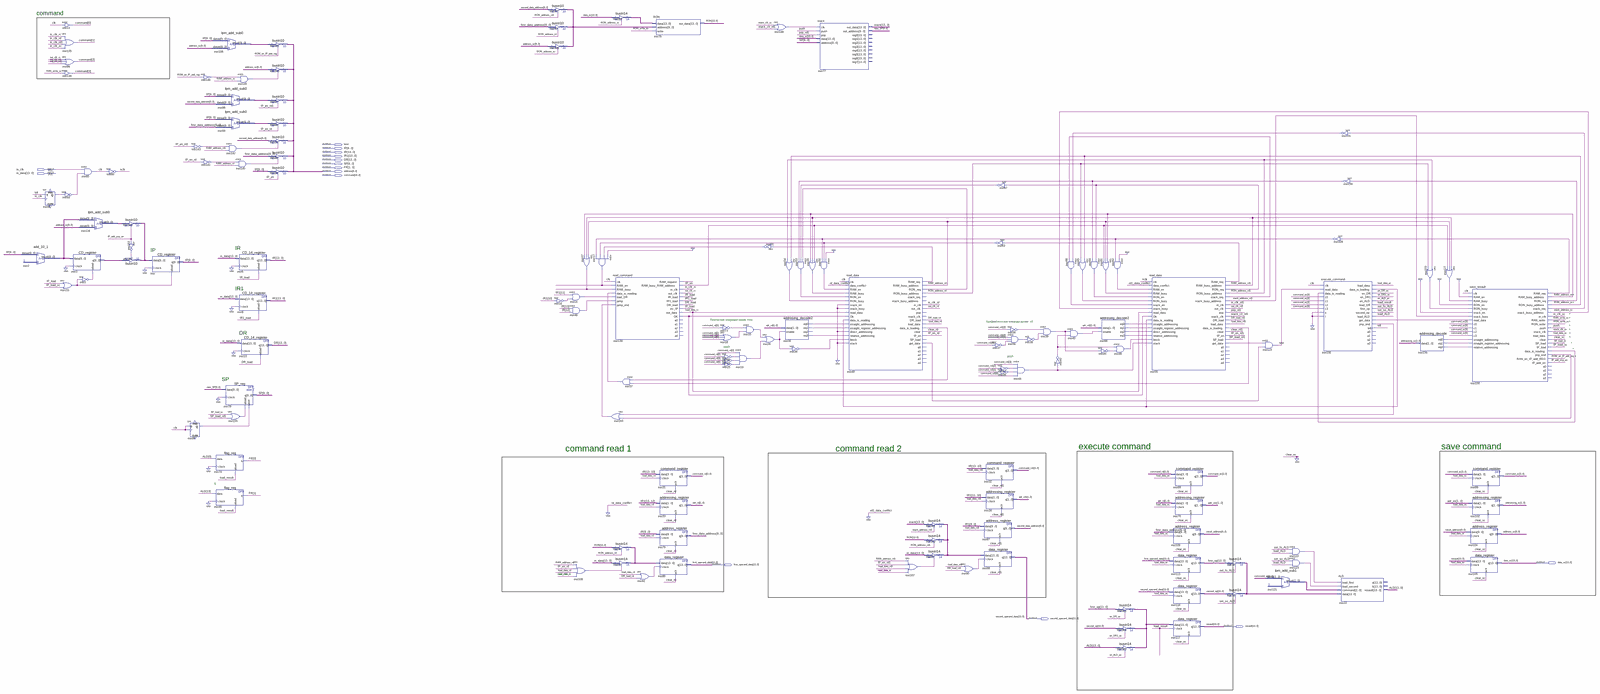
[diagram p0: schematic sheet, whole]
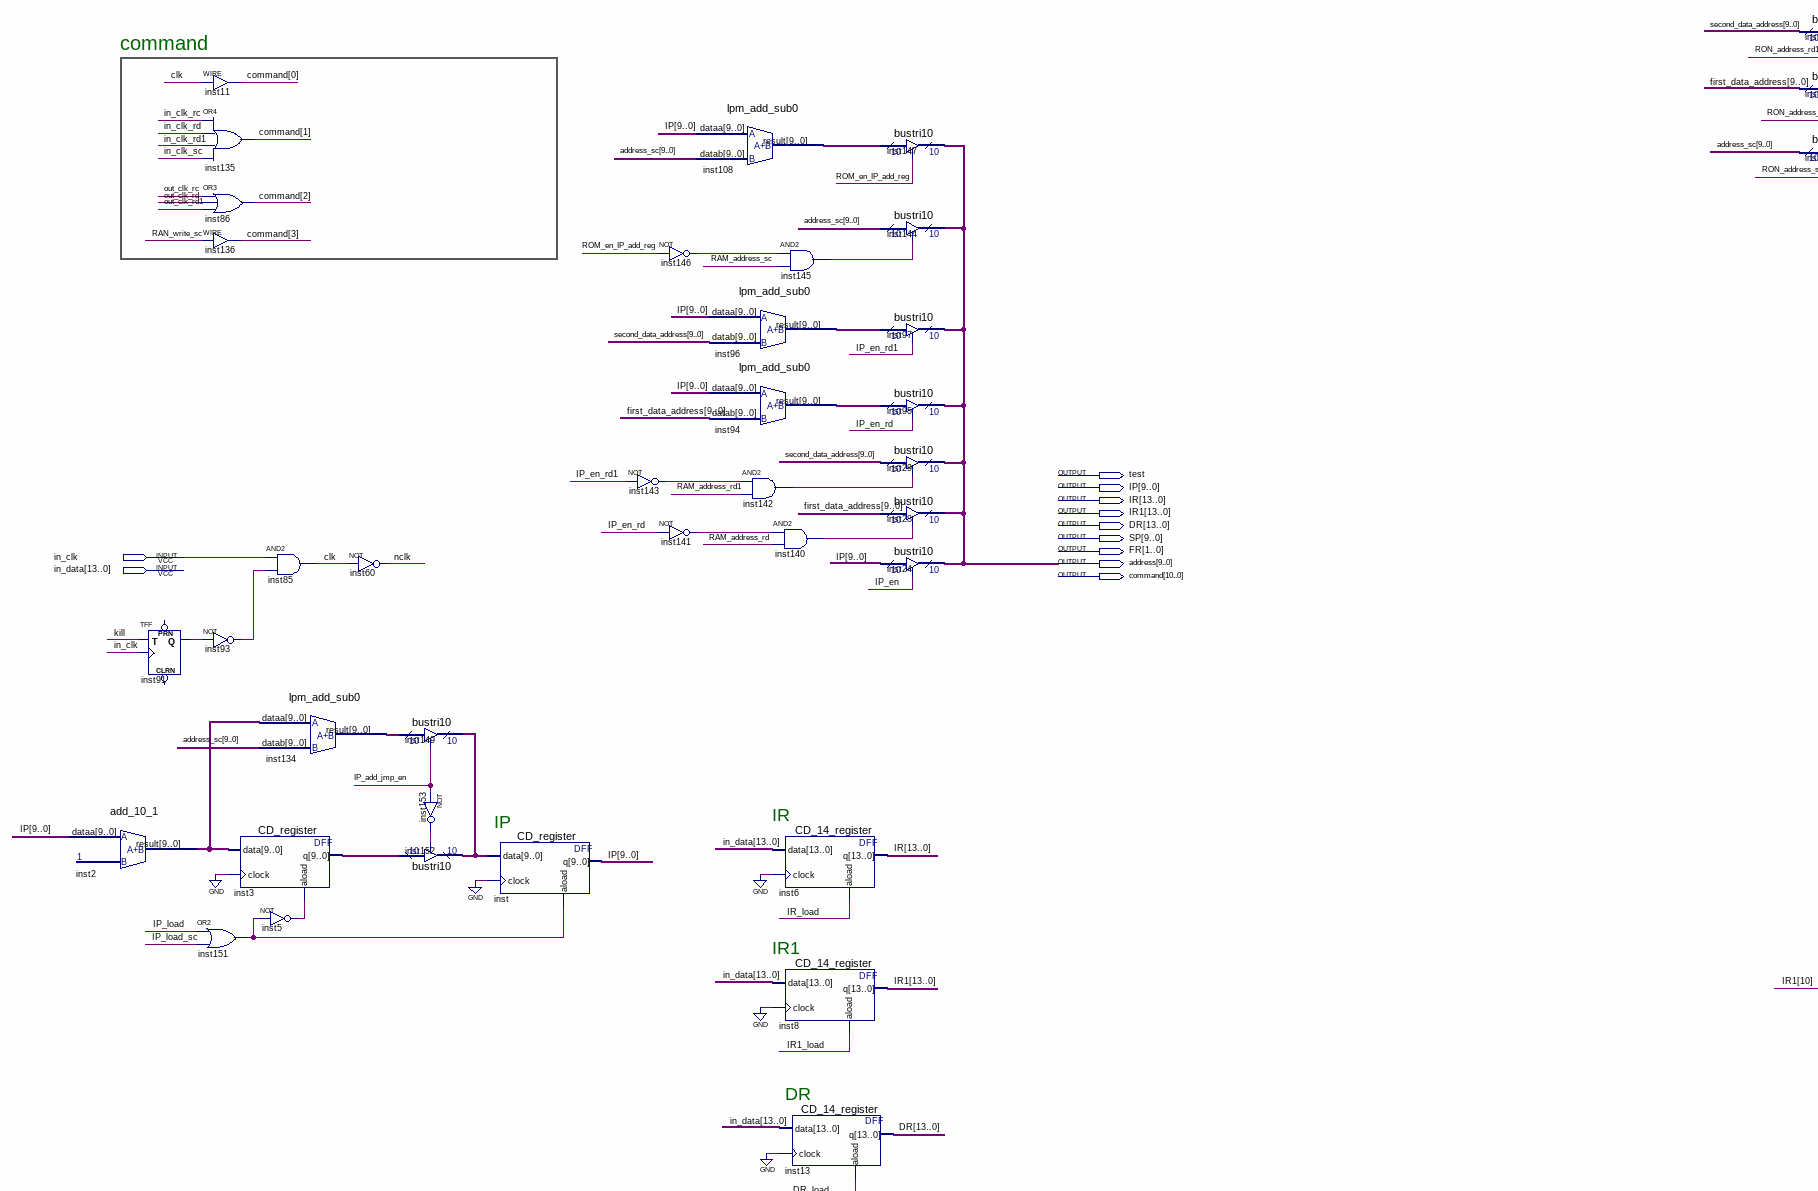
[diagram p1: schematic sheet, upper left part]
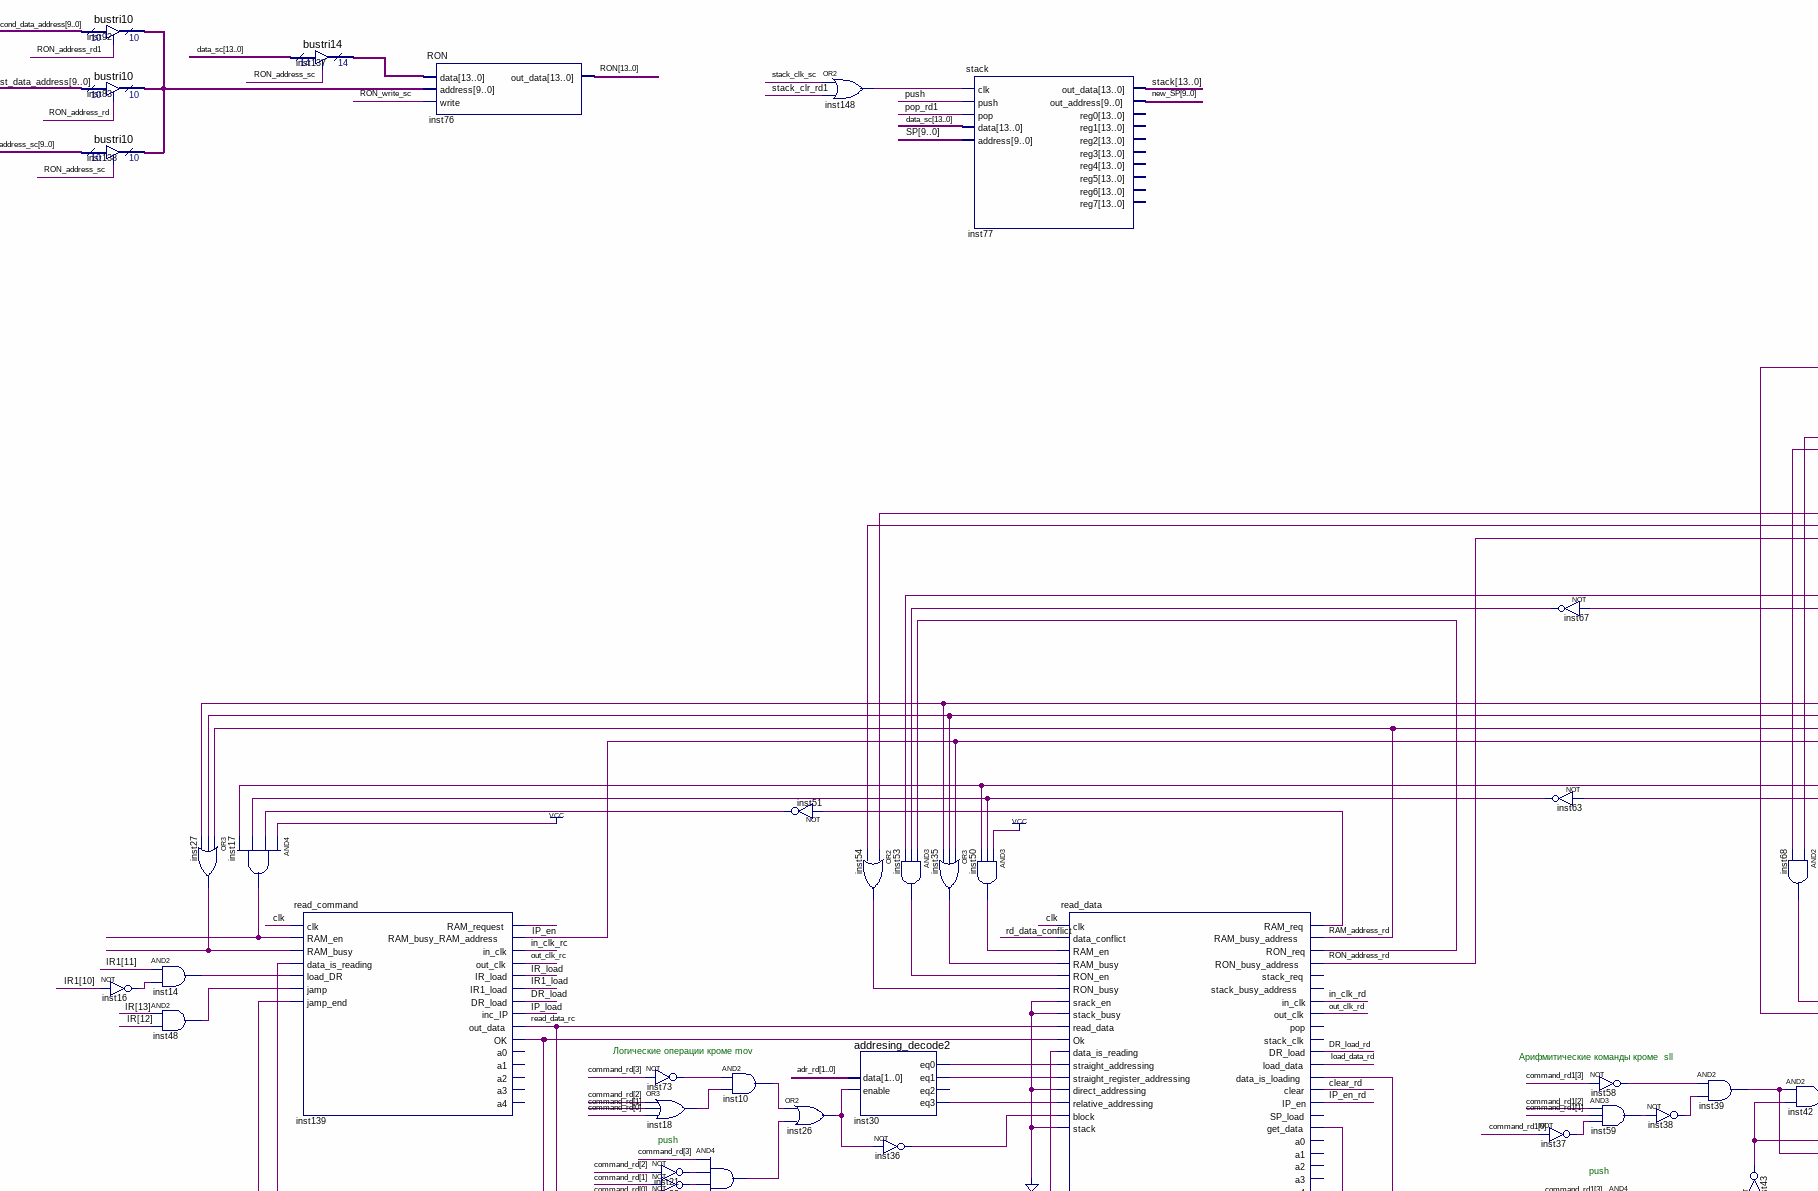
[diagram p2: schematic sheet, upper centre part]
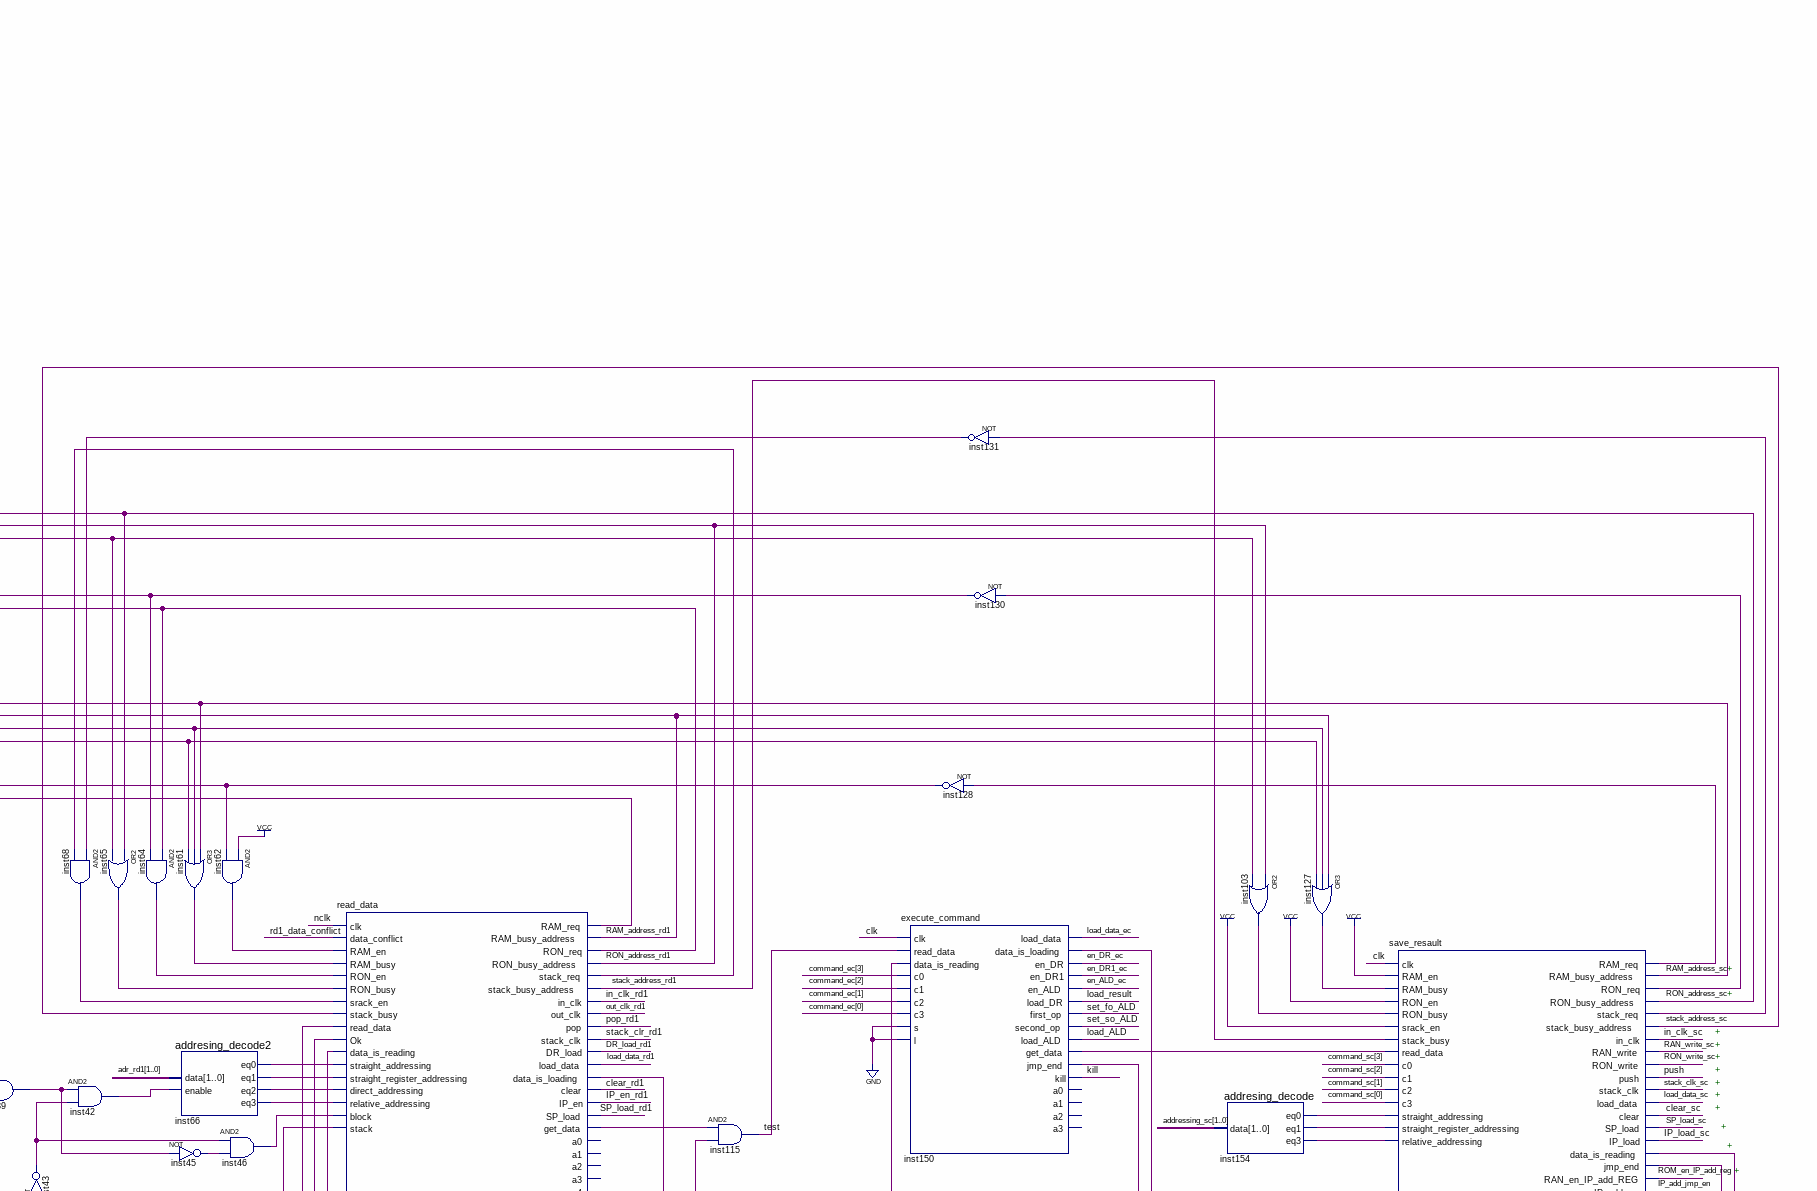
[diagram p3: schematic sheet, upper right part]
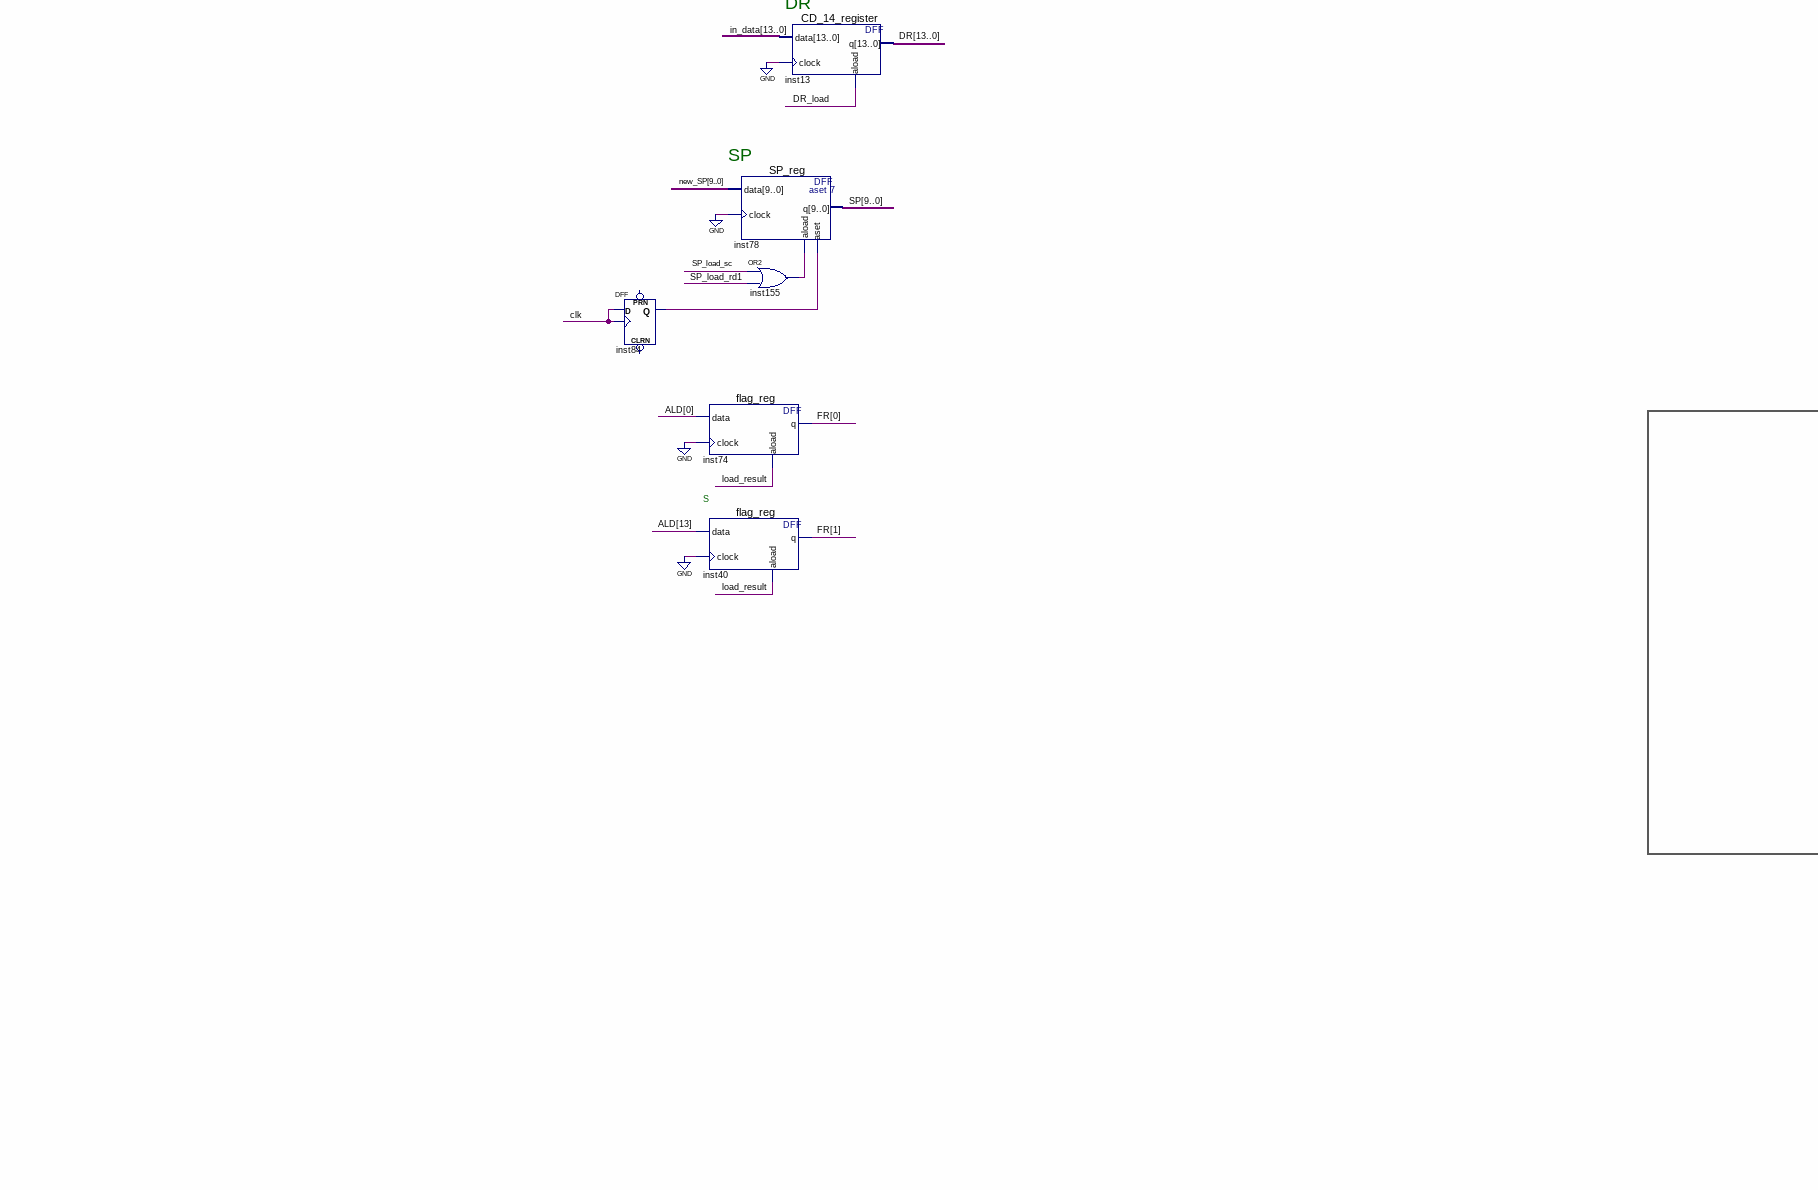
[diagram p4: schematic sheet, lower left part]
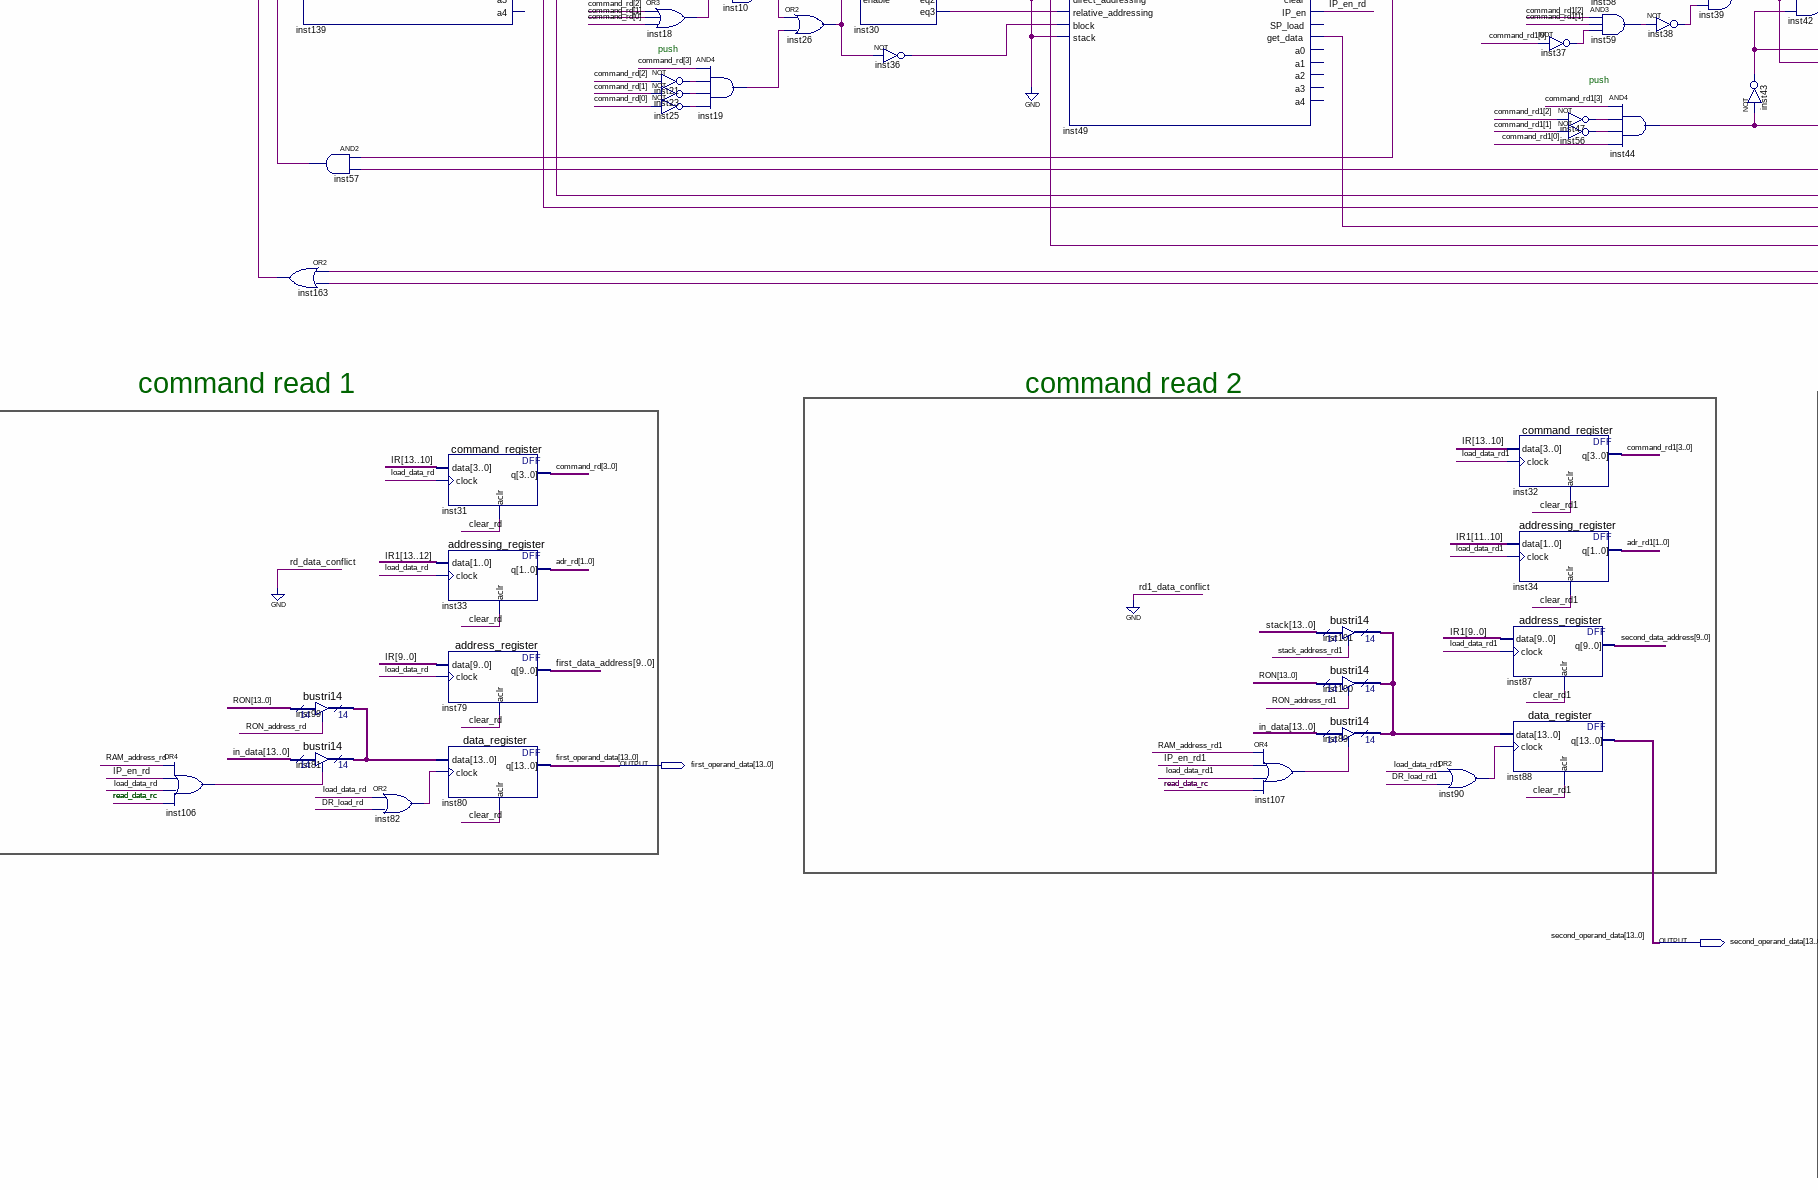
[diagram p5: schematic sheet, lower centre part]
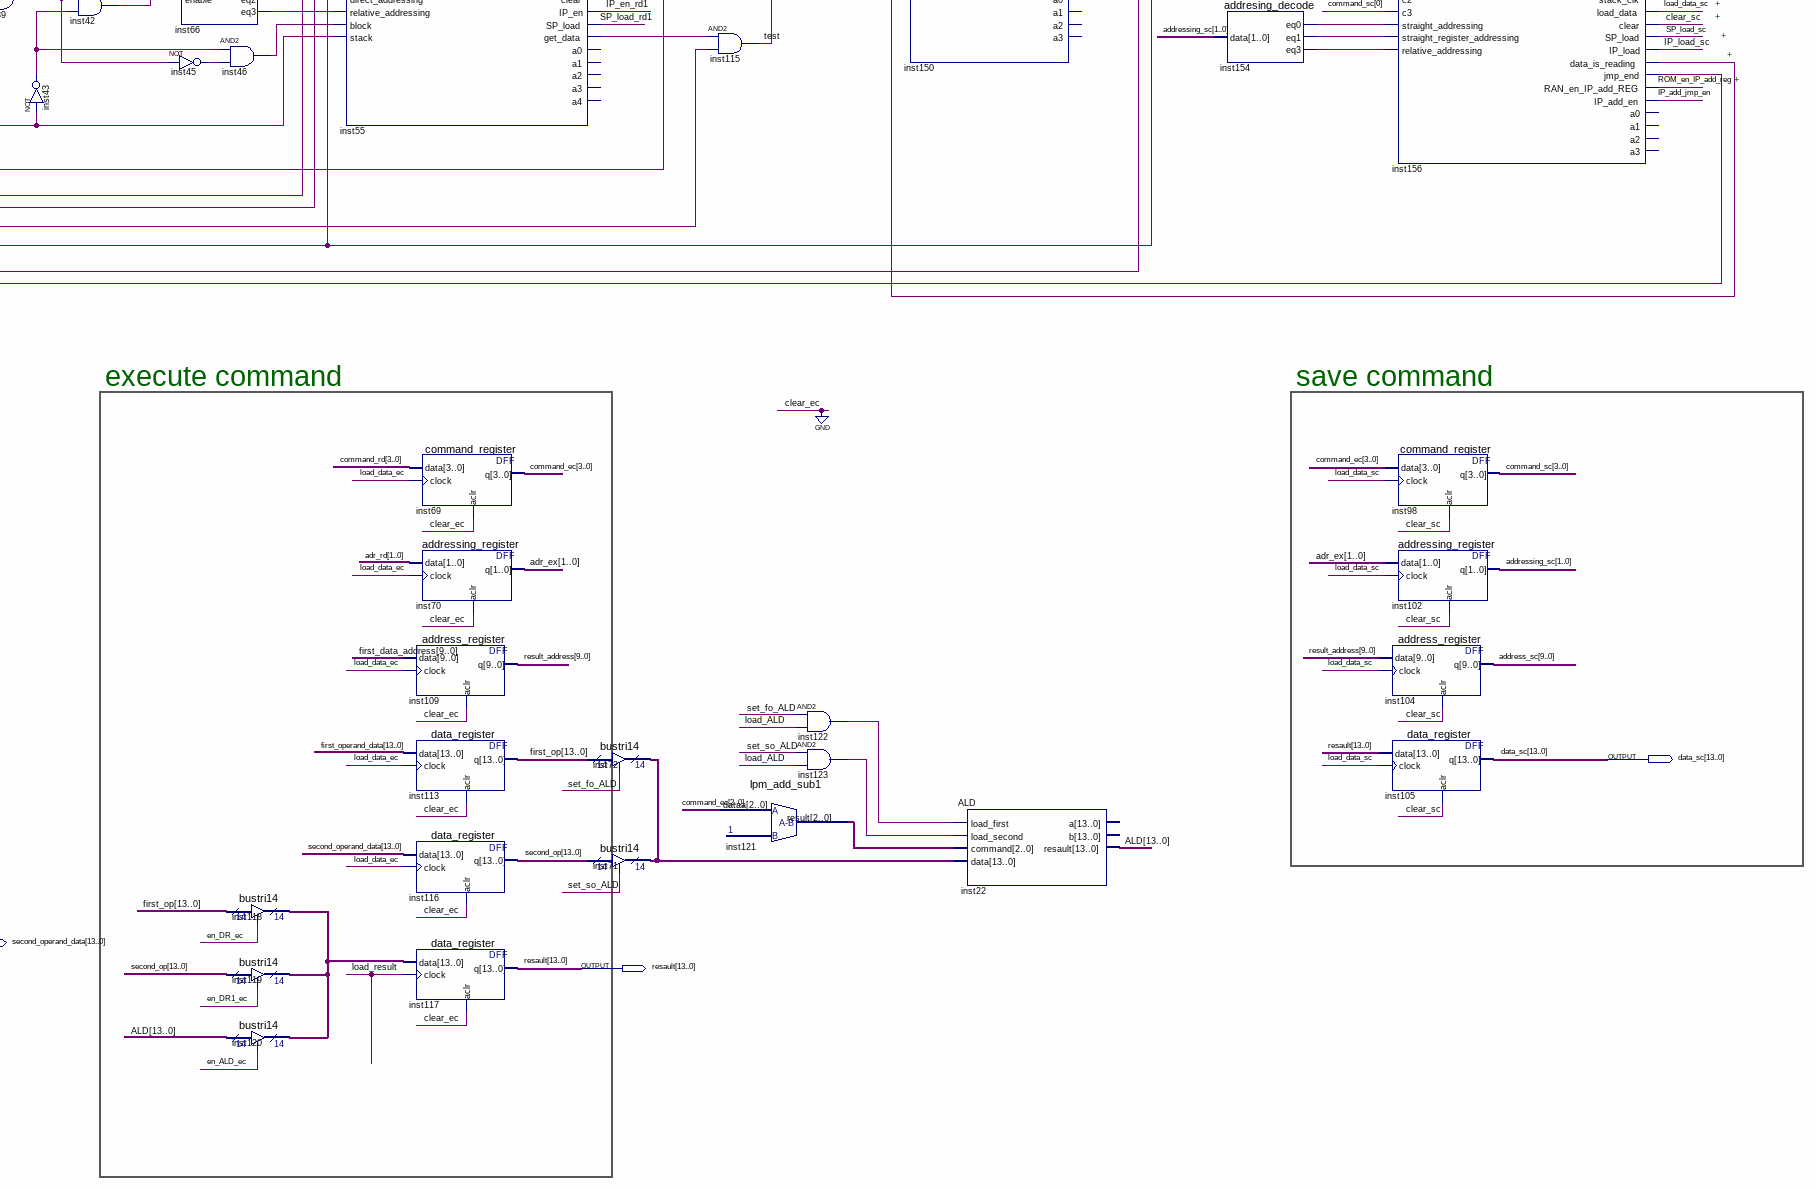
[diagram p6: schematic sheet, lower right part]
// Quartus schematic CD.bdf as structural Verilog: 138 symbols, 15 pins
module CD (
  input  in_clk,
  input  [13:0] in_data,
  output test,
  output [9:0] IP,
  output [13:0] IR,
  output [13:0] IR1,
  output [13:0] DR,
  output [9:0] SP,
  output [1:0] FR,
  output [9:0] address,
  output [10:0] command,
  output [13:0] data_sc,
  output [13:0] first_operand_data,
  output [13:0] second_operand_data,
  output [13:0] resault
);

  wire clear_rd, clear_rd1, clear_sc, clk, DR_load, DR_load_rd, DR_load_rd1, en_ALD_ec, en_DR1_ec, en_DR_ec,
       in_clk_rc, in_clk_rd, in_clk_rd1, in_clk_sc, inst5_out, inst10_out, inst14_out, inst16_out,
       inst17_out, inst18_out, inst19_out, inst21_out, inst23_out, inst25_out, inst26_out, inst27_out,
       inst30_eq0, inst30_eq1, inst30_eq3, inst35_out, inst36_out, inst37_out, inst38_out, inst39_out,
       inst42_out, inst43_out, inst44_out, inst45_out, inst46_out, inst47_out, inst48_out,
       inst49_data_is_loading, inst49_get_data, inst49_ram_req, inst49_ron_req, inst50_out, inst51_out,
       inst53_out, inst54_out, inst55_data_is_loading, inst55_get_data, inst55_ram_req, inst55_ron_req,
       inst55_stack_req, inst56_out, inst57_out, inst58_out, inst59_out, inst61_out, inst62_out, inst63_out,
       inst64_out, inst65_out, inst66_eq0, inst66_eq1, inst66_eq2, inst66_eq3, inst67_out, inst68_out,
       inst73_out, inst82_out, inst84_q, inst90_out, inst91_q, inst93_out, inst103_out, inst106_out,
       inst107_out, inst122_out, inst123_out, inst127_out, inst128_out, inst130_out, inst131_out, inst139_ok,
       inst139_ram_request, inst140_out, inst141_out, inst142_out, inst143_out, inst145_out, inst146_out,
       inst148_out, inst150_data_is_loading, inst150_get_data, inst150_jmp_end, inst151_out, inst153_out,
       inst154_eq0, inst154_eq1, inst154_eq3, inst155_out, inst156_data_is_reading, inst156_jmp_end,
       inst156_ram_req, inst156_ron_req, inst156_stack_req, inst163_out, IP_add_jmp_en, IP_en, IP_en_rd,
       IP_en_rd1, IP_load, IP_load_sc, IR1_load, IR_load, kill, load_ALD, load_data_ec, load_data_rd,
       load_data_rd1, load_data_sc, load_result, nclk, out_clk_rc, out_clk_rd, out_clk_rd1, pop_rd1, push,
       RAM_address_rd, RAM_address_rd1, RAM_address_sc, RAN_write_sc, read_data_rc, ROM_en_IP_add_reg,
       RON_address_rd, RON_address_rd1, RON_address_sc, RON_write_sc, set_fo_ALD, set_so_ALD, SP_load_rd1,
       SP_load_sc, stack_address_rd1, stack_address_sc, stack_clk_sc, stack_clr_rd1;
  wire [1:0] addressing_sc, adr_ex, adr_rd, adr_rd1;
  wire [2:0] inst121_result;
  wire [3:0] command_ec, command_rd, command_rd1, command_sc;
  wire [9:0] address_sc, first_data_address, inst2_result, inst3_q, inst92_tridata, inst94_result,
       inst96_result, inst108_result, inst134_result, inst149_tridata, new_SP, result_address,
       second_data_address;
  wire [13:0] ALD, first_op, inst72_tridata, inst99_tridata, inst101_tridata, inst118_tridata,
       inst137_tridata, RON, second_op, stack;

  add_10_1 inst2 (.dataa(IP), .result(inst2_result));
  TFF inst91 (.T(kill), .CLK(in_clk), .Q(inst91_q));  // open: PRN, CLRN
  assign command[0] = clk;  // WIRE inst11
  or inst135 (command[1], in_clk_rc, in_clk_rd, in_clk_rd1, in_clk_sc);
  or inst86 (command[2], out_clk_rc, out_clk_rd, out_clk_rd1);
  assign command[3] = RAN_write_sc;  // WIRE inst136
  not inst93 (inst93_out, inst91_q);
  or inst151 (inst151_out, IP_load, IP_load_sc);
  and inst85 (clk, in_clk, inst93_out);
  lpm_add_sub0 inst134 (.dataa(inst2_result), .datab(address_sc), .result(inst134_result));
  CD_register inst3 (.data(inst2_result), .clock(1'b0), .aload(inst5_out), .q(inst3_q));
  not inst5 (inst5_out, inst151_out);
  not inst60 (nclk, clk);
  bustri10 inst149 (.enabledt(IP_add_jmp_en), .data(inst134_result), .tridata(inst149_tridata));
  not inst153 (inst153_out, IP_add_jmp_en);
  bustri10 inst152 (.enabledt(inst153_out), .data(inst3_q), .tridata(inst149_tridata));
  CD_register inst (.data(inst149_tridata), .clock(1'b0), .aload(inst151_out), .q(IP));
  not inst143 (inst143_out, IP_en_rd1);
  DFF inst84 (.CLK(clk), .D(clk), .Q(inst84_q));  // open: CLRN, PRN
  not inst146 (inst146_out, ROM_en_IP_add_reg);
  not inst141 (inst141_out, IP_en_rd);
  lpm_add_sub0 inst108 (.dataa(IP), .datab(address_sc), .result(inst108_result));
  lpm_add_sub0 inst96 (.dataa(IP), .datab(second_data_address), .result(inst96_result));
  lpm_add_sub0 inst94 (.dataa(IP), .datab(first_data_address), .result(inst94_result));
  SP_reg inst78 (.data(new_SP), .clock(1'b0), .aload(inst155_out), .aset(inst84_q), .q(SP));
  flag_reg inst74 (.data(ALD[0]), .clock(1'b0), .aload(load_result), .q(FR[0]));
  flag_reg inst40 (.data(ALD[13]), .clock(1'b0), .aload(load_result), .q(FR[1]));
  and inst145 (inst145_out, inst146_out, RAM_address_sc);
  and inst142 (inst142_out, inst143_out, RAM_address_rd1);
  and inst140 (inst140_out, inst141_out, RAM_address_rd);
  CD_14_register inst6 (.data(in_data), .clock(1'b0), .aload(IR_load), .q(IR));
  CD_14_register inst8 (.data(in_data), .clock(1'b0), .aload(IR1_load), .q(IR1));
  CD_14_register inst13 (.data(in_data), .clock(1'b0), .aload(DR_load), .q(DR));
  or inst155 (inst155_out, SP_load_sc, SP_load_rd1);
  bustri10 inst147 (.enabledt(ROM_en_IP_add_reg), .data(inst108_result), .tridata(address));
  bustri10 inst144 (.enabledt(inst145_out), .data(address_sc), .tridata(address));
  bustri10 inst97 (.enabledt(IP_en_rd1), .data(inst96_result), .tridata(address));
  bustri10 inst95 (.enabledt(IP_en_rd), .data(inst94_result), .tridata(address));
  bustri10 inst29 (.enabledt(inst142_out), .data(second_data_address), .tridata(address));
  bustri10 inst28 (.enabledt(inst140_out), .data(first_data_address), .tridata(address));
  bustri10 inst24 (.enabledt(IP_en), .data(IP), .tridata(address));
  bustri10 inst92 (.enabledt(RON_address_rd1), .data(second_data_address), .tridata(inst92_tridata));
  bustri10 inst83 (.enabledt(RON_address_rd), .data(first_data_address), .tridata(inst92_tridata));
  bustri10 inst138 (.enabledt(RON_address_sc), .data(address_sc), .tridata(inst92_tridata));
  not inst16 (inst16_out, IR1[10]);
  and inst14 (inst14_out, IR1[11], inst16_out);
  and inst48 (inst48_out, IR[13], IR[12]);
  or inst106 (inst106_out, RAM_address_rd, IP_en_rd, load_data_rd, read_data_rc);
  and inst17 (inst17_out, 1'b1, inst51_out, inst63_out, inst128_out);
  or inst27 (inst27_out, RAM_address_rd, RAM_address_rd1, RAM_address_sc);
  or inst163 (inst163_out, inst150_jmp_end, inst156_jmp_end);
  bustri14 inst137 (.enabledt(RON_address_sc), .data(data_sc), .tridata(inst137_tridata));
  read_command inst139 (
    .clk(clk), .RAM_en(inst17_out), .RAM_busy(inst27_out), .data_is_reading(inst57_out),
    .load_DR(inst14_out), .jamp(inst48_out), .jamp_end(inst163_out), .RAM_request(inst139_ram_request),
    .RAM_busy_RAM_address(IP_en), .in_clk(in_clk_rc), .out_clk(out_clk_rc), .IR_load(IR_load),
    .IR1_load(IR1_load), .DR_load(DR_load), .inc_IP(IP_load), .out_data(read_data_rc), .OK(inst139_ok));  // open: a0, a1, a2, a3, a4
  and inst57 (inst57_out, inst49_data_is_loading, inst55_data_is_loading);
  bustri14 inst99 (.enabledt(RON_address_rd), .data(RON), .tridata(inst99_tridata));
  bustri14 inst81 (.enabledt(inst106_out), .data(in_data), .tridata(inst99_tridata));
  or inst82 (inst82_out, load_data_rd, DR_load_rd);
  RON inst76 (.data(inst137_tridata), .address(inst92_tridata), .write(RON_write_sc), .out_data(RON));
  command_register inst31 (.data(IR[13:10]), .clock(load_data_rd), .aclr(clear_rd), .q(command_rd));
  addressing_register inst33 (.data(IR1[13:12]), .clock(load_data_rd), .aclr(clear_rd), .q(adr_rd));
  address_register inst79 (.data(IR[9:0]), .clock(load_data_rd), .aclr(clear_rd), .q(first_data_address));
  data_register inst80 (.data(inst99_tridata), .clock(inst82_out), .aclr(clear_rd), .q(first_operand_data));
  not inst73 (inst73_out, command_rd[3]);
  or inst18 (inst18_out, command_rd[2], command_rd[1], command_rd[0]);
  not inst21 (inst21_out, command_rd[2]);
  not inst23 (inst23_out, command_rd[1]);
  not inst25 (inst25_out, command_rd[0]);
  and inst10 (inst10_out, inst73_out, inst18_out);
  and inst19 (inst19_out, command_rd[3], inst21_out, inst23_out, inst25_out);
  not inst51 (inst51_out, inst49_ram_req);
  or inst26 (inst26_out, inst10_out, inst19_out);
  or inst148 (inst148_out, stack_clk_sc, stack_clr_rd1);
  or inst54 (inst54_out, RON_address_sc, RON_address_rd1);
  addresing_decode2 inst30 (
    .data(adr_rd), .enable(inst26_out), .eq0(inst30_eq0), .eq1(inst30_eq1), .eq3(inst30_eq3));  // open: eq2
  not inst36 (inst36_out, inst26_out);
  or inst35 (inst35_out, IP_en, RAM_address_rd1, RAM_address_sc);
  and inst53 (inst53_out, inst49_ron_req, inst67_out, inst130_out);
  stack inst77 (
    .clk(inst148_out), .push(push), .pop(pop_rd1), .data(data_sc), .address(SP), .out_data(stack),
    .out_address(new_SP));  // open: reg0, reg1, reg2, reg3, reg4, reg5, reg6, reg7
  and inst50 (inst50_out, 1'b1, inst63_out, inst128_out);
  read_data inst49 (
    .clk(clk), .data_conflict(1'b0), .RAM_en(inst50_out), .RAM_busy(inst35_out), .RON_en(inst53_out),
    .RON_busy(inst54_out), .srack_en(1'b0), .stack_busy(1'b0), .read_data(read_data_rc), .Ok(inst139_ok),
    .data_is_reading(inst150_data_is_loading), .straight_addressing(inst30_eq0),
    .straight_register_addressing(inst30_eq1), .direct_addressing(1'b0), .relative_addressing(inst30_eq3),
    .block(inst36_out), .stack(1'b0), .RAM_req(inst49_ram_req), .RAM_busy_address(RAM_address_rd),
    .RON_req(inst49_ron_req), .RON_busy_address(RON_address_rd), .in_clk(in_clk_rd), .out_clk(out_clk_rd),
    .DR_load(DR_load_rd), .load_data(load_data_rd), .data_is_loading(inst49_data_is_loading),
    .clear(clear_rd), .IP_en(IP_en_rd), .get_data(inst49_get_data));  // open: stack_req, stack_busy_address, pop, stack_clk, SP_load, a0, a1, a2, a3, a4
  or inst107 (inst107_out, RAM_address_rd1, IP_en_rd1, load_data_rd1, read_data_rc);
  bustri14 inst101 (.enabledt(stack_address_rd1), .data(stack), .tridata(inst101_tridata));
  bustri14 inst100 (.enabledt(RON_address_rd1), .data(RON), .tridata(inst101_tridata));
  bustri14 inst89 (.enabledt(inst107_out), .data(in_data), .tridata(inst101_tridata));
  or inst90 (inst90_out, load_data_rd1, DR_load_rd1);
  not inst63 (inst63_out, inst55_ram_req);
  not inst37 (inst37_out, command_rd1[0]);
  command_register inst32 (.data(IR[13:10]), .clock(load_data_rd1), .aclr(clear_rd1), .q(command_rd1));
  addressing_register inst34 (.data(IR1[11:10]), .clock(load_data_rd1), .aclr(clear_rd1), .q(adr_rd1));
  address_register inst87 (.data(IR1[9:0]), .clock(load_data_rd1), .aclr(clear_rd1), .q(second_data_address));
  data_register inst88 (.data(inst101_tridata), .clock(inst90_out), .aclr(clear_rd1), .q(second_operand_data));
  not inst67 (inst67_out, inst55_ron_req);
  not inst58 (inst58_out, command_rd1[3]);
  and inst59 (inst59_out, command_rd1[2], command_rd1[1], inst37_out);
  not inst47 (inst47_out, command_rd1[2]);
  not inst56 (inst56_out, command_rd1[1]);
  not inst38 (inst38_out, inst59_out);
  and inst44 (inst44_out, command_rd1[3], inst47_out, inst56_out, command_rd1[0]);
  and inst39 (inst39_out, inst58_out, inst38_out);
  not inst43 (inst43_out, inst44_out);
  and inst68 (inst68_out, inst131_out, inst55_stack_req);
  and inst42 (inst42_out, inst39_out, inst43_out);
  or inst65 (inst65_out, RON_address_sc, RON_address_rd);
  or inst61 (inst61_out, RAM_address_sc, RAM_address_rd, IP_en);
  and inst64 (inst64_out, inst55_ron_req, inst130_out);
  addresing_decode2 inst66 (
    .data(adr_rd1), .enable(inst42_out), .eq0(inst66_eq0), .eq1(inst66_eq1), .eq2(inst66_eq2),
    .eq3(inst66_eq3));
  not inst45 (inst45_out, inst39_out);
  and inst62 (inst62_out, 1'b1, inst128_out);
  and inst46 (inst46_out, inst43_out, inst45_out);
  bustri14 inst118 (.enabledt(en_DR_ec), .data(first_op), .tridata(inst118_tridata));
  bustri14 inst119 (.enabledt(en_DR1_ec), .data(second_op), .tridata(inst118_tridata));
  bustri14 inst120 (.enabledt(en_ALD_ec), .data(ALD), .tridata(inst118_tridata));
  read_data inst55 (
    .clk(nclk), .data_conflict(1'b0), .RAM_en(inst62_out), .RAM_busy(inst61_out), .RON_en(inst64_out),
    .RON_busy(inst65_out), .srack_en(inst68_out), .stack_busy(stack_address_sc), .read_data(read_data_rc),
    .Ok(inst139_ok), .data_is_reading(inst150_data_is_loading), .straight_addressing(inst66_eq0),
    .straight_register_addressing(inst66_eq1), .direct_addressing(inst66_eq2),
    .relative_addressing(inst66_eq3), .block(inst46_out), .stack(inst44_out), .RAM_req(inst55_ram_req),
    .RAM_busy_address(RAM_address_rd1), .RON_req(inst55_ron_req), .RON_busy_address(RON_address_rd1),
    .stack_req(inst55_stack_req), .stack_busy_address(stack_address_rd1), .in_clk(in_clk_rd1),
    .out_clk(out_clk_rd1), .pop(pop_rd1), .stack_clk(stack_clr_rd1), .DR_load(DR_load_rd1),
    .load_data(load_data_rd1), .data_is_loading(inst55_data_is_loading), .clear(clear_rd1),
    .IP_en(IP_en_rd1), .SP_load(SP_load_rd1), .get_data(inst55_get_data));  // open: a0, a1, a2, a3, a4
  command_register inst69 (.data(command_rd), .clock(load_data_ec), .aclr(1'b0), .q(command_ec));
  addressing_register inst70 (.data(adr_rd), .clock(load_data_ec), .aclr(1'b0), .q(adr_ex));
  address_register inst109 (.data(first_data_address), .clock(load_data_ec), .aclr(1'b0), .q(result_address));
  data_register inst113 (.data(first_operand_data), .clock(load_data_ec), .aclr(1'b0), .q(first_op));
  data_register inst116 (.data(second_operand_data), .clock(load_data_ec), .aclr(1'b0), .q(second_op));
  data_register inst117 (.data(inst118_tridata), .clock(load_result), .aclr(1'b0), .q(resault));
  bustri14 inst72 (.enabledt(set_fo_ALD), .data(first_op), .tridata(inst72_tridata));
  bustri14 inst71 (.enabledt(set_so_ALD), .data(second_op), .tridata(inst72_tridata));
  and inst115 (test, inst55_get_data, inst49_get_data);
  lpm_add_sub1 inst121 (.dataa(command_ec[2:0]), .result(inst121_result));
  and inst122 (inst122_out, set_fo_ALD, load_ALD);
  and inst123 (inst123_out, set_so_ALD, load_ALD);
  not inst128 (inst128_out, inst156_ram_req);
  execute_command inst150 (
    .clk(clk), .read_data(test), .data_is_reading(inst156_data_is_reading), .c0(command_ec[3]),
    .c1(command_ec[2]), .c2(command_ec[1]), .c3(command_ec[0]), .s(1'b0), .l(1'b0), .load_data(load_data_ec),
    .data_is_loading(inst150_data_is_loading), .en_DR(en_DR_ec), .en_DR1(en_DR1_ec), .en_ALD(en_ALD_ec),
    .load_DR(load_result), .first_op(set_fo_ALD), .second_op(set_so_ALD), .load_ALD(load_ALD),
    .get_data(inst150_get_data), .jmp_end(inst150_jmp_end), .kill(kill));  // open: a0, a1, a2, a3
  not inst131 (inst131_out, inst156_stack_req);
  not inst130 (inst130_out, inst156_ron_req);
  ALD inst22 (
    .load_first(inst122_out), .load_second(inst123_out), .command(inst121_result), .data(inst72_tridata),
    .resault(ALD));  // open: a, b
  or inst103 (inst103_out, RON_address_rd1, RON_address_rd);
  addresing_decode inst154 (.data(addressing_sc), .eq0(inst154_eq0), .eq1(inst154_eq1), .eq3(inst154_eq3));
  or inst127 (inst127_out, RAM_address_rd1, RAM_address_rd, IP_en);
  save_resault inst156 (
    .clk(clk), .RAM_en(1'b1), .RAM_busy(inst127_out), .RON_en(1'b1), .RON_busy(inst103_out), .srack_en(1'b1),
    .stack_busy(stack_address_rd1), .read_data(inst150_get_data), .c0(command_sc[3]), .c1(command_sc[2]),
    .c2(command_sc[1]), .c3(command_sc[0]), .straight_addressing(inst154_eq0),
    .straight_register_addressing(inst154_eq1), .relative_addressing(inst154_eq3), .RAM_req(inst156_ram_req),
    .RAM_busy_address(RAM_address_sc), .RON_req(inst156_ron_req), .RON_busy_address(RON_address_sc),
    .stack_req(inst156_stack_req), .stack_busy_address(stack_address_sc), .in_clk(in_clk_sc),
    .RAN_write(RAN_write_sc), .RON_write(RON_write_sc), .push(push), .stack_clk(stack_clk_sc),
    .load_data(load_data_sc), .clear(clear_sc), .SP_load(SP_load_sc), .IP_load(IP_load_sc),
    .data_is_reading(inst156_data_is_reading), .jmp_end(inst156_jmp_end),
    .RAN_en_IP_add_REG(ROM_en_IP_add_reg), .IP_add_en(IP_add_jmp_en));  // open: a0, a1, a2, a3
  command_register inst98 (.data(command_ec), .clock(load_data_sc), .aclr(clear_sc), .q(command_sc));
  addressing_register inst102 (.data(adr_ex), .clock(load_data_sc), .aclr(clear_sc), .q(addressing_sc));
  address_register inst104 (.data(result_address), .clock(load_data_sc), .aclr(clear_sc), .q(address_sc));
  data_register inst105 (.data(resault), .clock(load_data_sc), .aclr(clear_sc), .q(data_sc));

  // Notes on the sheet:
  //   command
  //   IR
  //   IP
  //   IR1
  //   +
  //   +
  //   +
  //   +
  //   Логические операции кроме mov
  //   Арифмитические команды кроме  sll
  //   +
  //   +
  //   +
  //   DR
  //   +
  //   +
  //   +
  //   push
  //   +
  //   push
  //   +
  //   SP
  //   execute command
  //   save command
  //   command read 1
  //   command read 2
  //   S
  //   read_data_rc
  //   read_data_rc
endmodule
